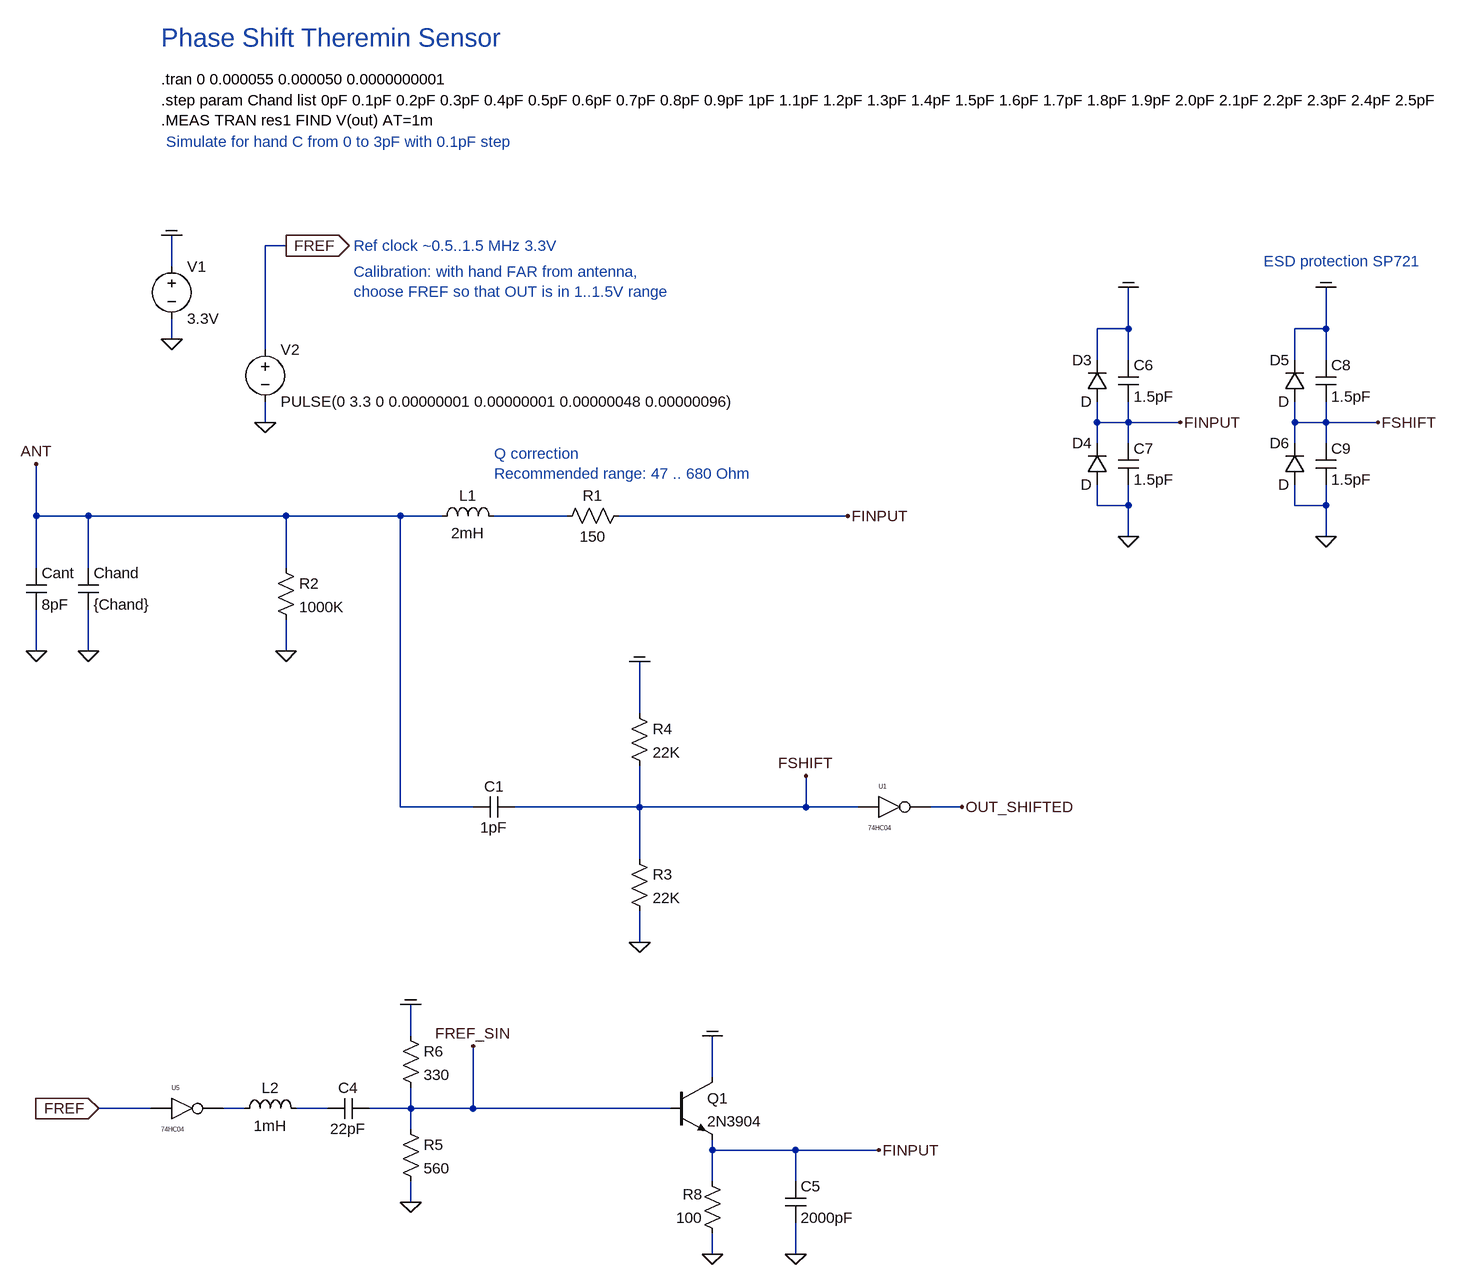
[diagram p0: schematic phase_shift_sensor_v3.asc]
phase_shift_sensor_v3.asc, the LTspice schematic file:
Version 4
SHEET 1 3724 1652
WIRE 224 -48 192 -48
WIRE 48 -16 48 -64
WIRE 1520 80 1520 16
WIRE 1520 80 1472 80
WIRE 1824 80 1824 16
WIRE 1824 80 1776 80
WIRE 48 96 48 64
WIRE 192 112 192 -48
WIRE 1472 128 1472 80
WIRE 1520 128 1520 80
WIRE 1776 128 1776 80
WIRE 1824 128 1824 80
WIRE 192 224 192 192
WIRE 1472 224 1472 192
WIRE 1520 224 1520 192
WIRE 1520 224 1472 224
WIRE 1600 224 1520 224
WIRE 1776 224 1776 192
WIRE 1824 224 1824 192
WIRE 1824 224 1776 224
WIRE 1904 224 1824 224
WIRE 1472 256 1472 224
WIRE 1520 256 1520 224
WIRE 1776 256 1776 224
WIRE 1824 256 1824 224
WIRE 1472 352 1472 320
WIRE 1520 352 1520 320
WIRE 1520 352 1472 352
WIRE 1776 352 1776 320
WIRE 1824 352 1824 320
WIRE 1824 352 1776 352
WIRE -160 368 -160 288
WIRE -80 368 -160 368
WIRE 224 368 -80 368
WIRE 400 368 224 368
WIRE 464 368 400 368
WIRE 656 368 544 368
WIRE 1088 368 736 368
WIRE 1520 400 1520 352
WIRE 1824 400 1824 352
WIRE -160 448 -160 368
WIRE -80 448 -80 368
WIRE 224 448 224 368
WIRE -160 576 -160 512
WIRE -80 576 -80 512
WIRE 224 576 224 528
WIRE 768 672 768 592
WIRE 400 816 400 368
WIRE 512 816 400 816
WIRE 768 816 768 752
WIRE 768 816 576 816
WIRE 1024 816 1024 768
WIRE 1024 816 768 816
WIRE 1104 816 1024 816
WIRE 1264 816 1216 816
WIRE 768 896 768 816
WIRE 768 1024 768 976
WIRE 416 1168 416 1120
WIRE 880 1232 880 1168
WIRE 16 1280 -64 1280
WIRE 160 1280 128 1280
WIRE 288 1280 240 1280
WIRE 416 1280 416 1248
WIRE 416 1280 352 1280
WIRE 512 1280 512 1184
WIRE 512 1280 416 1280
WIRE 816 1280 512 1280
WIRE 416 1312 416 1280
WIRE 880 1344 880 1328
WIRE 1008 1344 880 1344
WIRE 1136 1344 1008 1344
WIRE 880 1392 880 1344
WIRE 1008 1392 1008 1344
WIRE 416 1424 416 1392
WIRE 880 1504 880 1472
WIRE 1008 1504 1008 1456
FLAG 48 96 0
FLAG 224 -48 FREF
IOPIN 224 -48 Out
FLAG 192 224 0
FLAG -160 288 ANT
FLAG -160 576 0
FLAG -80 576 0
FLAG 48 -64 COM
FLAG 1520 400 0
FLAG 1520 16 COM
FLAG 1600 224 FINPUT
FLAG 1824 400 0
FLAG 1824 16 COM
FLAG 1024 768 FSHIFT
FLAG 1088 368 FINPUT
FLAG 1264 816 OUT_SHIFTED
FLAG 416 1424 0
FLAG 512 1184 FREF_SIN
FLAG -64 1280 FREF
IOPIN -64 1280 In
FLAG 416 1120 COM
FLAG 880 1168 COM
FLAG 1136 1344 FINPUT
FLAG 880 1504 0
FLAG 1008 1504 0
FLAG 1904 224 FSHIFT
FLAG 224 576 0
FLAG 768 1024 0
FLAG 768 592 COM
SYMBOL voltage 48 -32 R0
WINDOW 123 0 0 Left 2
WINDOW 39 0 0 Left 2
SYMATTR InstName V1
SYMATTR Value 3.3V
SYMBOL voltage 192 96 R0
WINDOW 123 0 0 Left 2
WINDOW 39 0 0 Left 2
SYMATTR InstName V2
SYMATTR Value PULSE(0 3.3 0 0.00000001 0.00000001 0.00000048 0.00000096)
SYMBOL ind 448 384 R270
WINDOW 0 32 56 VTop 2
WINDOW 3 5 56 VBottom 2
SYMATTR InstName L1
SYMATTR Value 2mH
SYMATTR SpiceLine Ipk=0.01 Rser=38.7 Rpar=11.3Meg Cpar=1.627pF
SYMBOL cap -176 448 R0
SYMATTR InstName Cant
SYMATTR Value 8pF
SYMBOL cap -96 448 R0
SYMATTR InstName Chand
SYMATTR Value {Chand}
SYMBOL diode 1488 192 R180
WINDOW 0 24 64 Left 2
WINDOW 3 24 0 Left 2
SYMATTR InstName D3
SYMBOL diode 1488 320 R180
WINDOW 0 24 64 Left 2
WINDOW 3 24 0 Left 2
SYMATTR InstName D4
SYMBOL cap 1504 128 R0
SYMATTR InstName C6
SYMATTR Value 1.5pF
SYMBOL cap 1504 256 R0
SYMATTR InstName C7
SYMATTR Value 1.5pF
SYMBOL diode 1792 192 R180
WINDOW 0 24 64 Left 2
WINDOW 3 24 0 Left 2
SYMATTR InstName D5
SYMBOL diode 1792 320 R180
WINDOW 0 24 64 Left 2
WINDOW 3 24 0 Left 2
SYMATTR InstName D6
SYMBOL cap 1808 128 R0
SYMATTR InstName C8
SYMATTR Value 1.5pF
SYMBOL cap 1808 256 R0
SYMATTR InstName C9
SYMATTR Value 1.5pF
SYMBOL ind 144 1296 R270
WINDOW 0 32 56 VTop 2
WINDOW 3 5 56 VBottom 2
SYMATTR InstName L2
SYMATTR Value 1mH
SYMATTR SpiceLine Ipk=0.06 Rser=30
SYMBOL cap 288 1296 R270
WINDOW 0 32 32 VTop 2
WINDOW 3 0 32 VBottom 2
SYMATTR InstName C4
SYMATTR Value 22pF
SYMBOL res 400 1296 R0
SYMATTR InstName R5
SYMATTR Value 560
SYMBOL EXTRA\\74HC\\74hc04 64 1216 R0
SYMATTR InstName U5
SYMATTR SpiceLine VCC=3.3  SPEED=1.0  TRIPDT=1e-9
SYMBOL res 400 1152 R0
SYMATTR InstName R6
SYMATTR Value 330
SYMBOL npn 816 1232 R0
SYMATTR InstName Q1
SYMATTR Value 2N3904
SYMBOL res 896 1488 R180
WINDOW 0 31 76 Left 2
WINDOW 3 31 40 Left 2
SYMATTR InstName R8
SYMATTR Value 100
SYMBOL cap 992 1392 R0
SYMATTR InstName C5
SYMATTR Value 2000pF
SYMBOL cap 576 800 R90
WINDOW 0 0 32 VBottom 2
WINDOW 3 32 32 VTop 2
SYMATTR InstName C1
SYMATTR Value 1pF
SYMBOL EXTRA\\74HC\\74hc04 1152 752 R0
SYMATTR InstName U1
SYMATTR SpiceLine VCC=3.3  SPEED=1.0  TRIPDT=1e-9
SYMBOL res 640 384 R270
WINDOW 0 32 56 VTop 2
WINDOW 3 0 56 VBottom 2
SYMATTR InstName R1
SYMATTR Value 150
SYMBOL res 208 432 R0
SYMATTR InstName R2
SYMATTR Value 1000K
SYMBOL res 752 880 R0
SYMATTR InstName R3
SYMATTR Value 22K
SYMBOL res 752 656 R0
SYMATTR InstName R4
SYMATTR Value 22K
TEXT 32 -304 Left 2 !.tran 0 0.000055 0.000050 0.0000000001
TEXT 32 -272 Left 2 !.step param Chand list 0pF 0.1pF 0.2pF 0.3pF 0.4pF 0.5pF 0.6pF 0.7pF 0.8pF 0.9pF 1pF 1.1pF 1.2pF 1.3pF 1.4pF 1.5pF 1.6pF 1.7pF 1.8pF 1.9pF 2.0pF 2.1pF 2.2pF 2.3pF 2.4pF 2.5pF\n.MEAS TRAN res1 FIND V(out) AT=1m
TEXT 328 -48 Left 2 ;Ref clock ~0.5..1.5 MHz 3.3V
TEXT 32 -368 Left 4 ;Phase Shift Theremin Sensor
TEXT 544 272 Left 2 ;Q correction\nRecommended range: 47 .. 680 Ohm
TEXT 1728 -24 Left 2 ;ESD protection SP721
TEXT 328 -8 Left 2 ;Calibration: with hand FAR from antenna,\nchoose FREF so that OUT is in 1..1.5V range
TEXT 40 -208 Left 2 ;Simulate for hand C from 0 to 3pF with 0.1pF step

The netlist it stands for:
* phase_shift_sensor_v3.asc
V1 COM 0 3.3V
V2 FREF 0 PULSE(0 3.3 0 0.00000001 0.00000001 0.00000048 0.00000096)
L1 ANT N001 2mH Ipk=0.01 Rser=38.7 Rpar=11.3Meg Cpar=1.627pF
Cant ANT 0 8pF
Chand ANT 0 {Chand}
D3 FINPUT COM D
D4 0 FINPUT D
C6 COM FINPUT 1.5pF
C7 FINPUT 0 1.5pF
D5 FSHIFT COM D
D6 0 FSHIFT D
C8 COM FSHIFT 1.5pF
C9 FSHIFT 0 1.5pF
L2 N002 N003 1mH Ipk=0.06 Rser=30
C4 N003 FREF_SIN 22pF
R5 FREF_SIN 0 560
XU5 FREF N002 VCC 0 74HC04 VCC=3.3  SPEED=1.0  TRIPDT=1e-9  ; pins A Y
R6 COM FREF_SIN 330
Q1 COM FREF_SIN FINPUT 0 2N3904
R8 0 FINPUT 100
C5 FINPUT 0 2000pF
C1 FSHIFT ANT 1pF
XU1 FSHIFT OUT_SHIFTED VCC 0 74HC04 VCC=3.3  SPEED=1.0  TRIPDT=1e-9  ; pins A Y
R1 N001 FINPUT 150
R2 ANT 0 1000K
R3 FSHIFT 0 22K
R4 COM FSHIFT 22K
.model D D
.lib standard.dio
.model NPN NPN
.model PNP PNP
.lib standard.bjt
.tran 0 0.000055 0.000050 0.0000000001
.step param Chand list 0pF 0.1pF 0.2pF 0.3pF 0.4pF 0.5pF 0.6pF 0.7pF 0.8pF 0.9pF 1pF 1.1pF 1.2pF 1.3pF 1.4pF 1.5pF 1.6pF 1.7pF 1.8pF 1.9pF 2.0pF 2.1pF 2.2pF 2.3pF 2.4pF 2.5pF
.MEAS TRAN res1 FIND V(out) AT=1m
* Ref clock ~0.5..1.5 MHz 3.3V
* Phase Shift Theremin Sensor
* Q correction
* Recommended range: 47 .. 680 Ohm
* ESD protection SP721
* Calibration: with hand FAR from antenna,
* choose FREF so that OUT is in 1..1.5V range
* Simulate for hand C from 0 to 3pF with 0.1pF step
.lib 74HC.lib
.backanno
.end